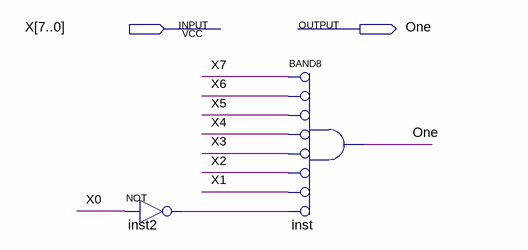
[diagram p0: schematic sheet]
// Quartus schematic OneDetector.bdf as structural Verilog: 2 symbols, 2 pins
module OneDetector (
  input  [7:0] X,
  output One
);

  wire inst2_out;

  not inst2 (inst2_out, X[0]);
  and inst (One, ~X[7], ~X[6], ~X[5], ~X[4], ~X[3], ~X[2], ~X[1], ~inst2_out);  // BAND8
endmodule
